# Altium schematic sheet Sheet1.SchDoc
size A; SheetNumber: 1; SheetTotal: 1
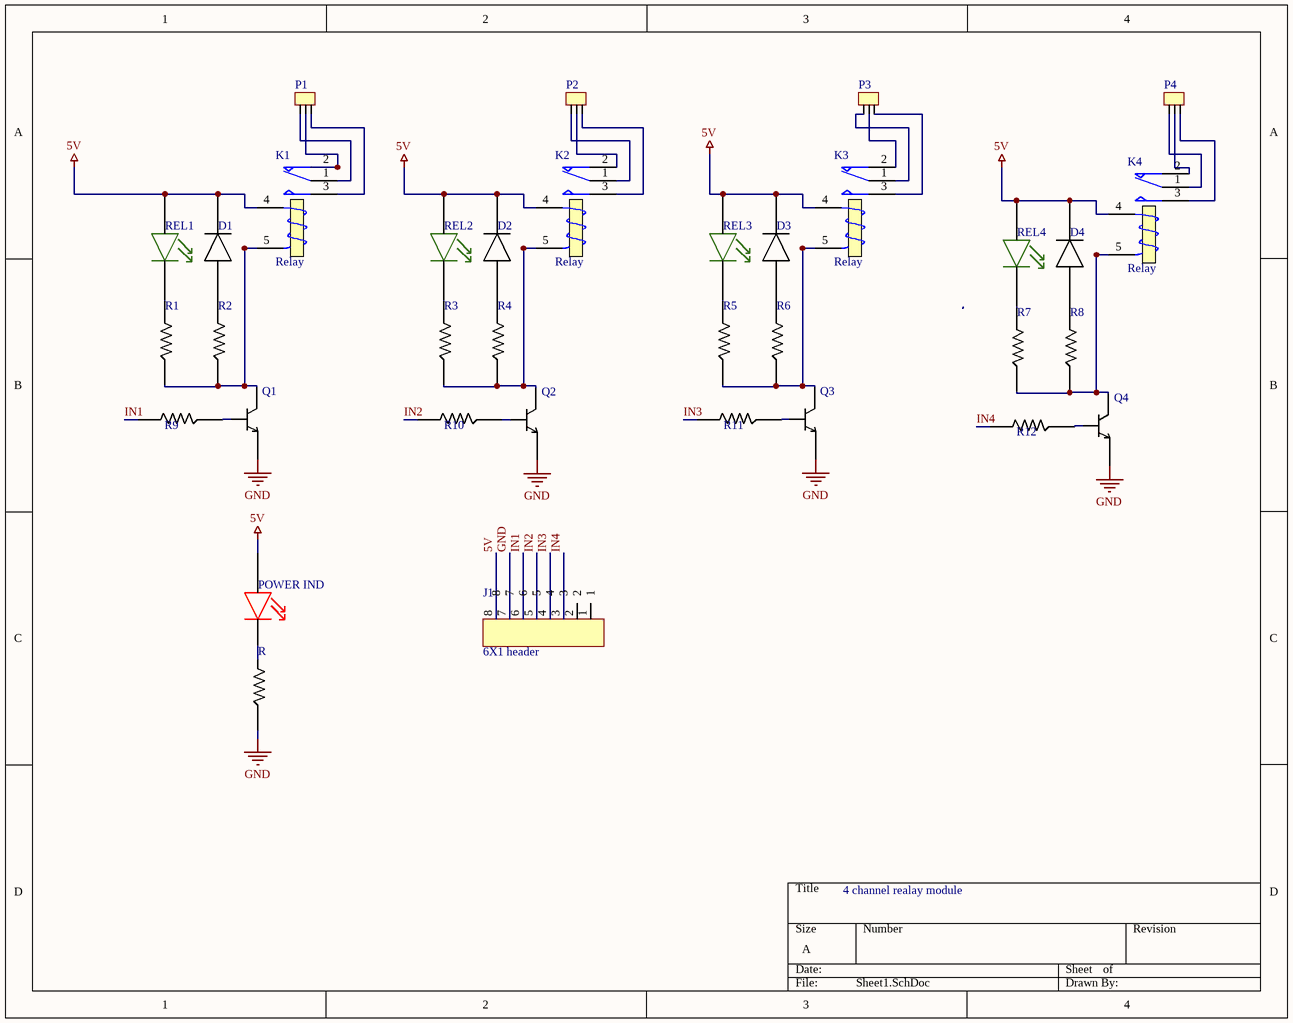
[diagram p0: Sheet1.SchDoc]

## Parts
D1  Diode  [Diode-1N4007]  (value not drawn)
D2  Diode  [Diode-1N4007]  (value not drawn)
D3  Diode  [Diode-1N4007]  (value not drawn)
D4  Diode  [Diode-1N4007]  (value not drawn)
J1  6X1 header  [6X1 pin header - duplicate]
K1  Relay  [MODULE5B]
K2  Relay  [MODULE5B]
K3  Relay  [MODULE5B]
K4  Relay  [MODULE5B]
P1  through hole screw terminal  [3X1 screw terminal]  (value not drawn)
P2  through hole screw terminal  [3X1 screw terminal]  (value not drawn)
P3  through hole screw terminal  [3X1 screw terminal]  (value not drawn)
P4  through hole screw terminal  [3X1 screw terminal]  (value not drawn)
POWER_IND  LED_RED_SMD  [LSM0805 Series green]  (value not drawn)
Q1  Q1  [transistor BC547 RCC1206 e3]  (value not drawn)
Q2  Q2  [transistor BC547 RCC1206 e3]  (value not drawn)
Q3  Q1  [transistor BC547 RCC1206 e3]  (value not drawn)
Q4  Q1  [transistor BC547 RCC1206 e3]  (value not drawn)
R  resistor  [Resistor-RCC1206 e3]  (value not drawn)
R1  resistor  [Resistor-RCC1206 e3]  (value not drawn)
R2  resistor  [Resistor-RCC1206 e3]  (value not drawn)
R3  resistor  [Resistor-RCC1206 e3]  (value not drawn)
R4  resistor  [Resistor-RCC1206 e3]  (value not drawn)
R5  resistor  [Resistor-RCC1206 e3]  (value not drawn)
R6  resistor  [Resistor-RCC1206 e3]  (value not drawn)
R7  resistor  [Resistor-RCC1206 e3]  (value not drawn)
R8  resistor  [Resistor-RCC1206 e3]  (value not drawn)
R9  resistor  [Resistor-RCC1206 e3]  (value not drawn)
R10  resistor  [Resistor-RCC1206 e3]  (value not drawn)
R11  resistor  [Resistor-RCC1206 e3]  (value not drawn)
R12  resistor  [Resistor-RCC1206 e3]  (value not drawn)
REL1  LED_GREEN_SMD  [LSM0805452V-Green]  (value not drawn)
REL2  LED_GREEN_SMD  [LSM0805452V-Green]  (value not drawn)
REL3  LED_GREEN_SMD  [LSM0805452V-Green]  (value not drawn)
REL4  LED_GREEN_SMD  [LSM0805452V-Green]  (value not drawn)

## Nets
5V: D1.K D2.K D3.K D4.K J1.8 K1.4(T1) K2.4(T1) K3.4(T1) K4.4(T1) POWER_IND.A REL1.A REL2.A REL3.A REL4.A
GND: J1.7 Q1.3(E) Q2.3(E) Q3.3(E) Q4.3(E) R.2
IN1: J1.6 R9.1
IN2: J1.5 R10.1
IN3: J1.4 R11.1
IN4: J1.3 R12.1
NetD1_A: D1.A R2.1
NetD2_A: D2.A R4.1
NetD3_A: D3.A R6.1
NetD4_A: D4.A R8.1
NetK1_1: K1.1(COM) P1.1
NetK1_2: K1.2(NC) P1.2
NetK1_3: K1.3(NO) P1.3
NetK1_5: K1.5(T2) Q1.1(C) R1.2 R2.2
NetK2_1: K2.1(COM) P2.1
NetK2_2: K2.2(NC) P2.2
NetK2_3: K2.3(NO) P2.3
NetK2_5: K2.5(T2) Q2.1(C) R3.2 R4.2
NetK3_1: K3.1(COM) P3.1
NetK3_2: K3.2(NC) P3.2
NetK3_3: K3.3(NO) P3.3
NetK3_5: K3.5(T2) Q3.1(C) R5.2 R6.2
NetK4_1: K4.1(COM) P4.1
NetK4_2: K4.2(NC) P4.2
NetK4_3: K4.3(NO) P4.3
NetK4_5: K4.5(T2) Q4.1(C) R7.2 R8.2
NetPOWER_IND_K: POWER_IND.K R.1
NetQ1_2: Q1.2(B) R9.2
NetQ2_2: Q2.2(B) R10.2
NetQ3_2: Q3.2(B) R11.2
NetQ4_2: Q4.2(B) R12.2
NetR1_1: R1.1 REL1.K
NetR3_1: R3.1 REL2.K
NetR5_1: R5.1 REL3.K
NetR7_1: R7.1 REL4.K

Not connected (* = marked no-connect by the designer): J1 1 2

## Notes on the sheet
- 4 channel realay module

## Library data of the parts
K1-K4 = Relay: SPDT Relay; Published: 8-Jun-2000; LatestRevisionDate: 17-Jul-2002; LatestRevisionNote: Re-released for DXP Platform.; PackageReference: MODULE5B; Publisher: Altium Limited
Q1-Q4 = BC547_SMD